# EAGLE schematic main (EAGLE 7.1.0)
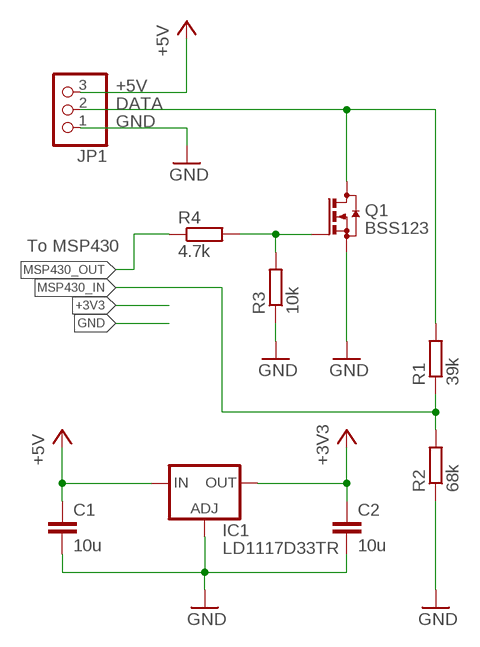
[diagram p0: schematic, sheet 1]

## Parts
C1  10u  C-EUC0805  [C0805]
C2  10u  C-EUC0805  [C0805]
IC1  LD1117D33TR  LD117ASTR  [SOT223]
JP1  PINHD-1X3  [1X03]
Q1  BSS123  [SOT23]
R1  39k  R-EU_M0805  [M0805]
R2  68k  R-EU_M0805  [M0805]
R3  10k  R-EU_M0805  [M0805]
R4  4.7k  R-EU_M0805  [M0805]

## Nets
+3V3: C2.1 IC1.4(OUT)
+5V: C1.1 IC1.3(IN) JP1.3
DATA: JP1.2 Q1.3(D) R1.2
GND: C1.2 C2.2 IC1.1(ADJ) JP1.1 Q1.2(S) R2.1 R3.1
MSP430_IN: R1.1 R2.2
MSP430_OUT: R4.1
N$1: Q1.1(G) R3.2 R4.2

## Notes on the sheet
- To MSP430

## Library data of the parts
C1 C2 = rcl:C-EU: CAPACITOR, European symbol
IC1 = v-reg:LD117A?*: Low drop fixed and adjustable positive voltage regulators 1 A Source: http://www.st.com/stonline/products/literature/ds/7194/ld1117axx.pdf
JP1 = pinhead:PINHD-1X3: PIN HEADER
Q1 = transistor-small-signal:BSS123: N-CHANNEL MOS FET
R1-R4 = rcl:R-EU_: RESISTOR, European symbol